# EAGLE design wireless_temp_sens (EAGLE 6.6.0)
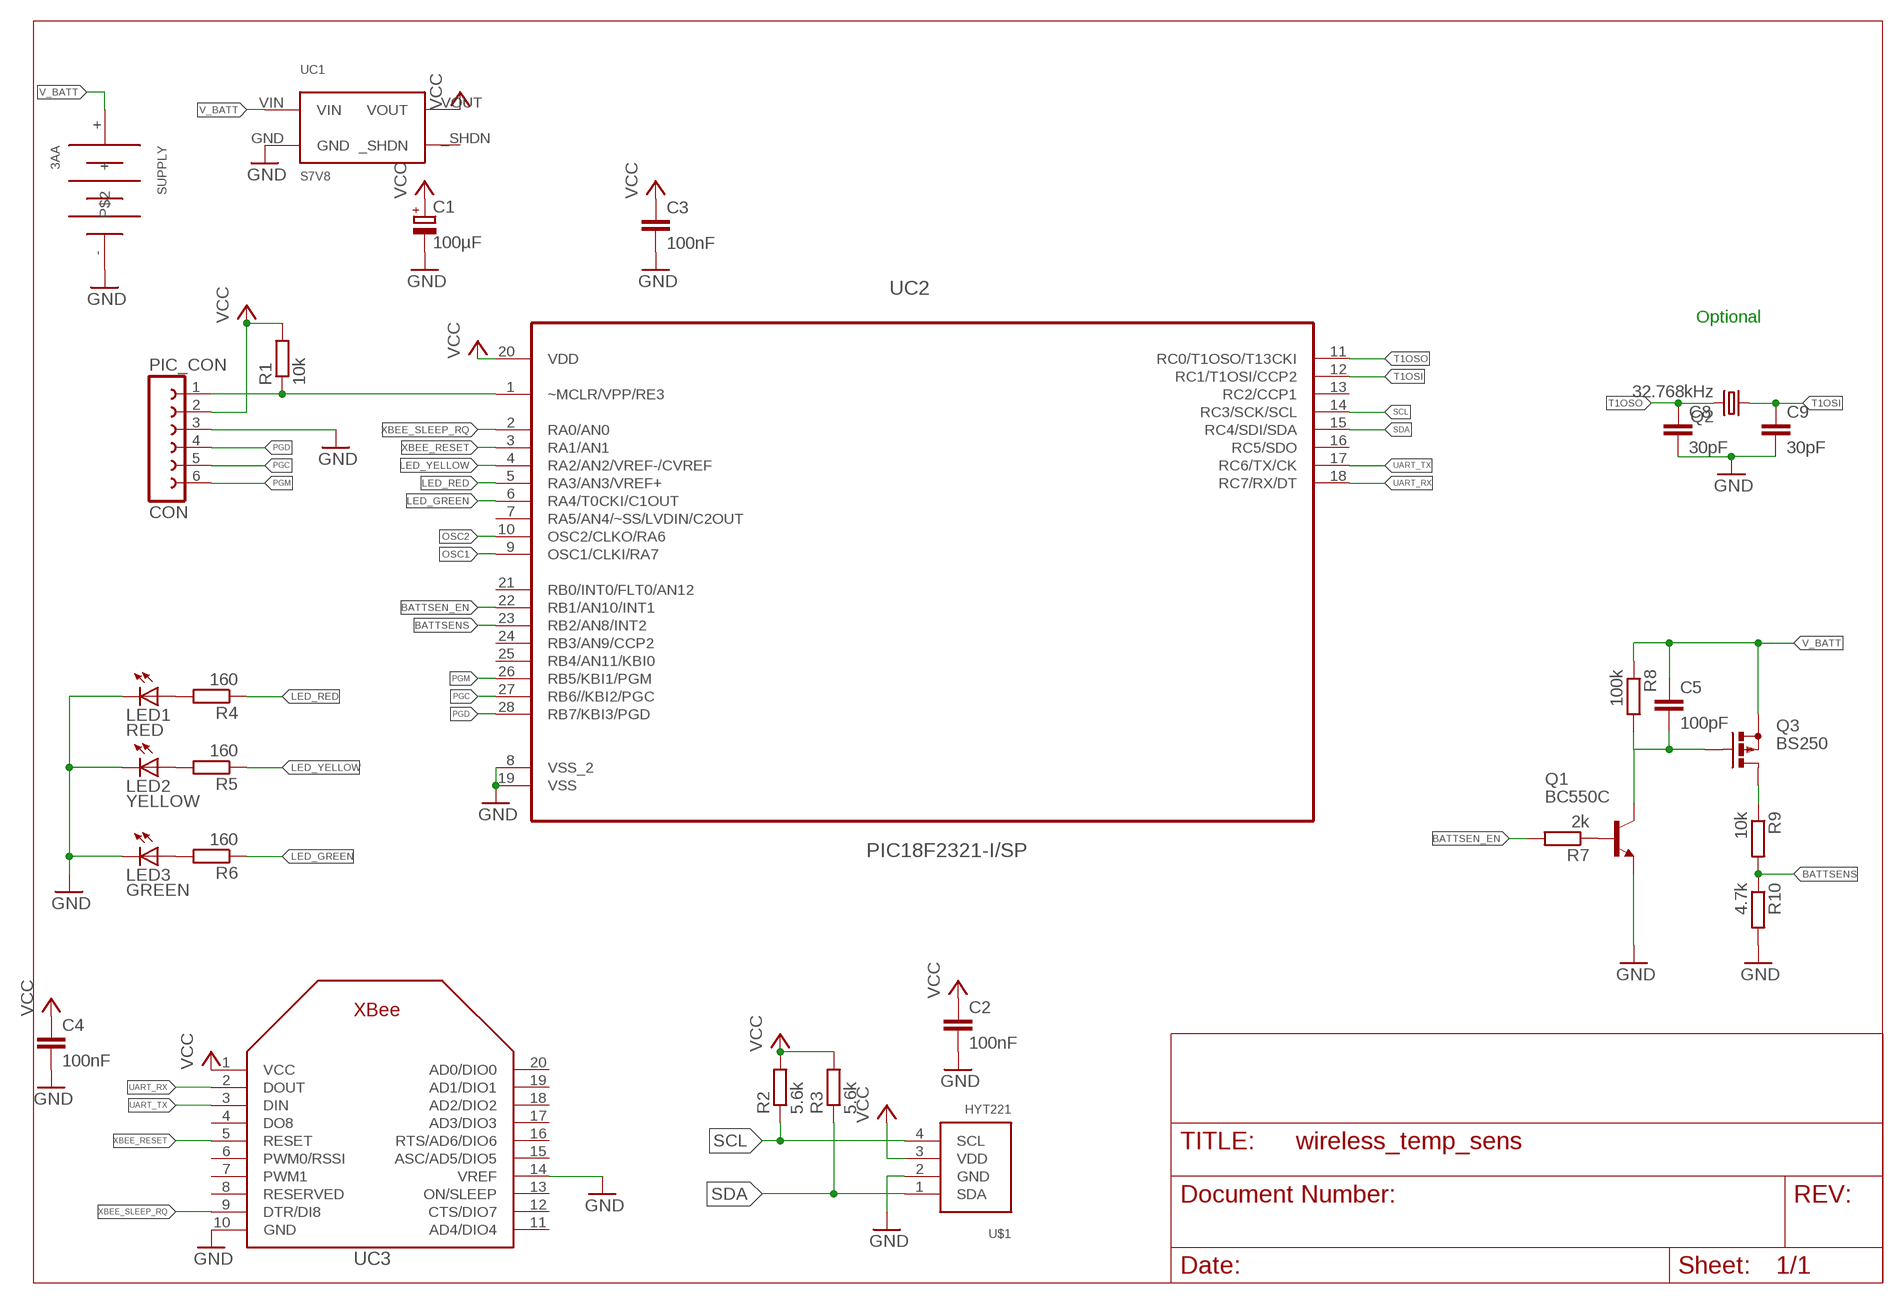
[diagram p0: schematic, sheet 1]

## Parts
C1  100µF  CPOL-EUE2.5-6  [E2,5-6]
C2  100nF  C-EU025-025X050  [C025-025X050]
C3  100nF  C-EU025-025X050  [C025-025X050]
C4  100nF  C-EU025-025X050  [C025-025X050]
C5  100pF  C-EU025-025X050  [C025-025X050]
C8  30pF  C-EU025-024X044  [C025-024X044]
C9  30pF  C-EU025-024X044  [C025-024X044]
CON  PIC_CON  FE06-1  [FE06]
LED1  RED  LED3MM  [LED3MM]
LED2  YELLOW  LED3MM  [LED3MM]
LED3  GREEN  LED3MM  [LED3MM]
Q1  BC550C  [TO92-EBC]
Q2  32.768kHz  CRYSTALTC26H  [TC26H]
Q3  BS250  [SOT54E]
R1  10k  R-EU_0204/7  [0204/7]
R2  5.6k  R-EU_0204/7  [0204/7]
R3  5.6k  R-EU_0204/7  [0204/7]
R4  160  R-EU_0204/7  [0204/7]
R5  160  R-EU_0204/7  [0204/7]
R6  160  R-EU_0204/7  [0204/7]
R7  2k  R-EU_0204/7  [0204/7]
R8  100k  R-EU_0204/7  [0204/7]
R9  10k  R-EU_0204/7  [0204/7]
R10  4.7k  R-EU_0204/7  [0204/7]
SUPPLY  3AA  [LR6-R6-R6P]
U$1  HYT221HYT221-CON  [HYT221-CON]
UC1  S7V8  [S7V8_P]
UC2  PIC18F2321-I/SP  [DIP254P762X508-28]
UC3  XBEE  [XBEE]

## Nets
BATTSEN_EN: R7.2 UC2.22(RB1/AN10/INT1)
BATTSENS: R9.2 R10.1 UC2.23(RB2/AN8/INT2)
GND: C1.- C2.2 C3.2 C4.2 C8.2 C9.2 CON.3 LED1.K(C) LED2.K(C) LED3.K(C) Q1.E R10.2 SUPPLY.- U$1.2(GND) UC1.GND UC2.8(VSS_2) UC2.19(VSS) UC3.10(GND) UC3.14(VREF)
LED_GREEN: R6.1 UC2.6(RA4/T0CKI/C1OUT)
LED_RED: R4.1 UC2.5(RA3/AN3/VREF+)
LED_YELLOW: R5.1 UC2.4(RA2/AN2/VREF-/CVREF)
N$1: Q1.B R7.1
N$2: CON.1 R1.1 UC2.1(~MCLR/VPP/RE3)
N$3: Q3.D R9.1
N$4: C5.2 Q1.C Q3.G R8.2
N$6: LED1.A R4.2
N$7: LED2.A R5.2
N$8: LED3.A R6.2
OSC1: UC2.9(OSC1/CLKI/RA7)
OSC2: UC2.10(OSC2/CLKO/RA6)
PGC: CON.5 UC2.27(RB6//KBI2/PGC)
PGD: CON.4 UC2.28(RB7/KBI3/PGD)
PGM: CON.6 UC2.26(RB5/KBI1/PGM)
SCL: R2.1 U$1.4(SCL) UC2.14(RC3/SCK/SCL)
SDA: R3.1 U$1.1(SDA) UC2.15(RC4/SDI/SDA)
T1OSI: C9.1 Q2.1 UC2.12(RC1/T1OSI/CCP2)
T1OSO: C8.1 Q2.2 UC2.11(RC0/T1OSO/T13CKI)
UART_RX: UC2.18(RC7/RX/DT) UC3.2(DOUT)
UART_TX: UC2.17(RC6/TX/CK) UC3.3(DIN)
V_BATT: C5.1 Q3.S R8.1 SUPPLY.+ UC1.VIN
VCC: C1.+ C2.1 C3.1 C4.1 CON.2 R1.2 R2.2 R3.2 U$1.3(VDD) UC1.VOUT UC2.20(VDD) UC3.1(VCC)
XBEE_RESET: UC2.3(RA1/AN1) UC3.5(RESET)
XBEE_SLEEP_RQ: UC2.2(RA0/AN0) UC3.9(DTR/DI8)
Unconnected: UC1._SHDN UC2.7(RA5/AN4/~SS/LVDIN/C2OUT) UC2.13(RC2/CCP1) UC2.16(RC5/SDO) UC2.21(RB0/INT0/FLT0/AN12) UC2.24(RB3/AN9/CCP2) UC2.25(RB4/AN11/KBI0) UC3.4(DO8) UC3.6(PWM0/RSSI) UC3.7(PWM1) UC3.8(RESERVED) UC3.11(AD4/DIO4) UC3.12(CTS/DIO7) UC3.13(ON/SLEEP) UC3.15(ASC/AD5/DIO5) UC3.16(RTS/AD6/DIO6) UC3.17(AD3/DIO3) UC3.18(AD2/DIO2) UC3.19(AD1/DIO1) UC3.20(AD0/DIO0)

## Notes on the sheet
- Optional

## Library data of the parts
C1 = resistor:CPOL-EU: POLARIZED CAPACITOR, European symbol
C2-C5 C8 C9 = rcl:C-EU: CAPACITOR, European symbol
CON = con-lsta:FE06-1: FEMALE HEADER; OC_FARNELL: unknown; OC_NEWARK: unknown
LED1-LED3 = led:LED: LED OSRAM: - CHIPLED LG R971, LG N971, LY N971, LG Q971, LY Q971, LO R971, LY R971 LH N974, LH R974 LS Q976, LO Q976, LY Q976 LO Q996 - Hyper CHIPLED LW Q18S LB Q993, LB Q99A, LB R99A - SideLED LS A670, LO A670, LY A670, LG A670, LP A670 LB A673, LV A673, LT A673, LW A673 LH A674 LY A675 LS A676, LA A676, LO A676, LY A676, LW A676 LS A679, LY A679, LG A679 - Hyper Micro SIDELED® LS Y876, LA Y876, LO Y876, LY Y876 LT Y87S - SmartLED LW L88C, LW L88S LB L89C, LB L89S, LG L890 LS L89K, LO L89K, LY L89K LS L896, LA L896, LO L896, LY L896 - TOPLED LS T670, LO T670, LY T670, LG T670, LP T670 LSG T670, LSP T670, LSY T670, LOP T670, LYG T670 LG T671, LOG T671, LSG T671 LB T673, LV T673, LT T673, LW T673 LH T674 LS T676, LA T676, LO T676, LY T676, LB T676, LH T676, LSB T676, LW T676 LB T67C, LV T67C, LT T67C, LS T67K, LO T67K, LY T67K, LW E67C LS E67B, LA E67B, LO E67B, LY E67B, LB E67C, LV E67C, LT E67C LW T67C LS T679, LY T679, LG T679 LS T770, LO T770, LY T770, LG T770, LP T770 LB T773, LV T773, LT T773, LW T773 LH T774 LS E675, LA E675, LY E675, LS T675 LS T776, LA T776, LO T776, LY T776, LB T776 LHGB T686 LT T68C, LB T68C - Hyper Mini TOPLED® LB M676 - Mini TOPLED Santana® LG M470 LS M47K, LO M47K, LY M47K Source: http://www.osram.convergy.de LUXEON: - LUMILED® LXK2-PW12-R00, LXK2-PW12-S00, LXK2-PW14-U00, LXK2-PW14-V00 LXK2-PM12-R00, LXK2-PM12-S00, LXK2-PM14-U00 LXK2-PE12-Q00, LXK2-PE12-R00, LXK2-PE12-S00, LXK2-PE14-T00, LXK2-PE14-U00 LXK2-PB12-K00, LXK2-PB12-L00, LXK2-PB12-M00, LXK2-PB14-N00, LXK2-PB14-P00, LXK2-PB14-Q00 LXK2-PR12-L00, LXK2-PR12-M00, LXK2-PR14-Q00, LXK2-PR14-R00 LXK2-PD12-Q00, LXK2-PD12-R00, LXK2-PD12-S00 LXK2-PH12-R00, LXK2-PH12-S00 LXK2-PL12-P00, LXK2-PL12-Q00, LXK2-PL12-R00 Source: www.luxeon.com KINGBRIGHT: KA-3528ASYC Source: www.kingbright.com
Q1 = transistor-npn:BC550*: NPN Transistor
Q2 = crystal:CRYSTAL: CRYSTAL; OC_FARNELL: unknown; OC_NEWARK: unknown
Q3 = transistor-small-signal:BS250: P-CHANNEL MOS FET
R1-R10 = rcl:R-EU_: RESISTOR, European symbol
SUPPLY = ma_libs:3AA
U$1 = ma_libs:HYT221
UC1 = ma_libs:S7V8
UC2 = Microchip_By_element14_Batch_1:PIC18F2321-I/SP: High-Performance Enhanced Flash Microcontrollers; MPN: PIC18F2321-I/SP; OC_FARNELL: 1332236; OC_NEWARK: 31K5012; PACKAGE: DIP-28; SUPPLIER: Microchip
UC3 = adafruit:XBEE

## Board
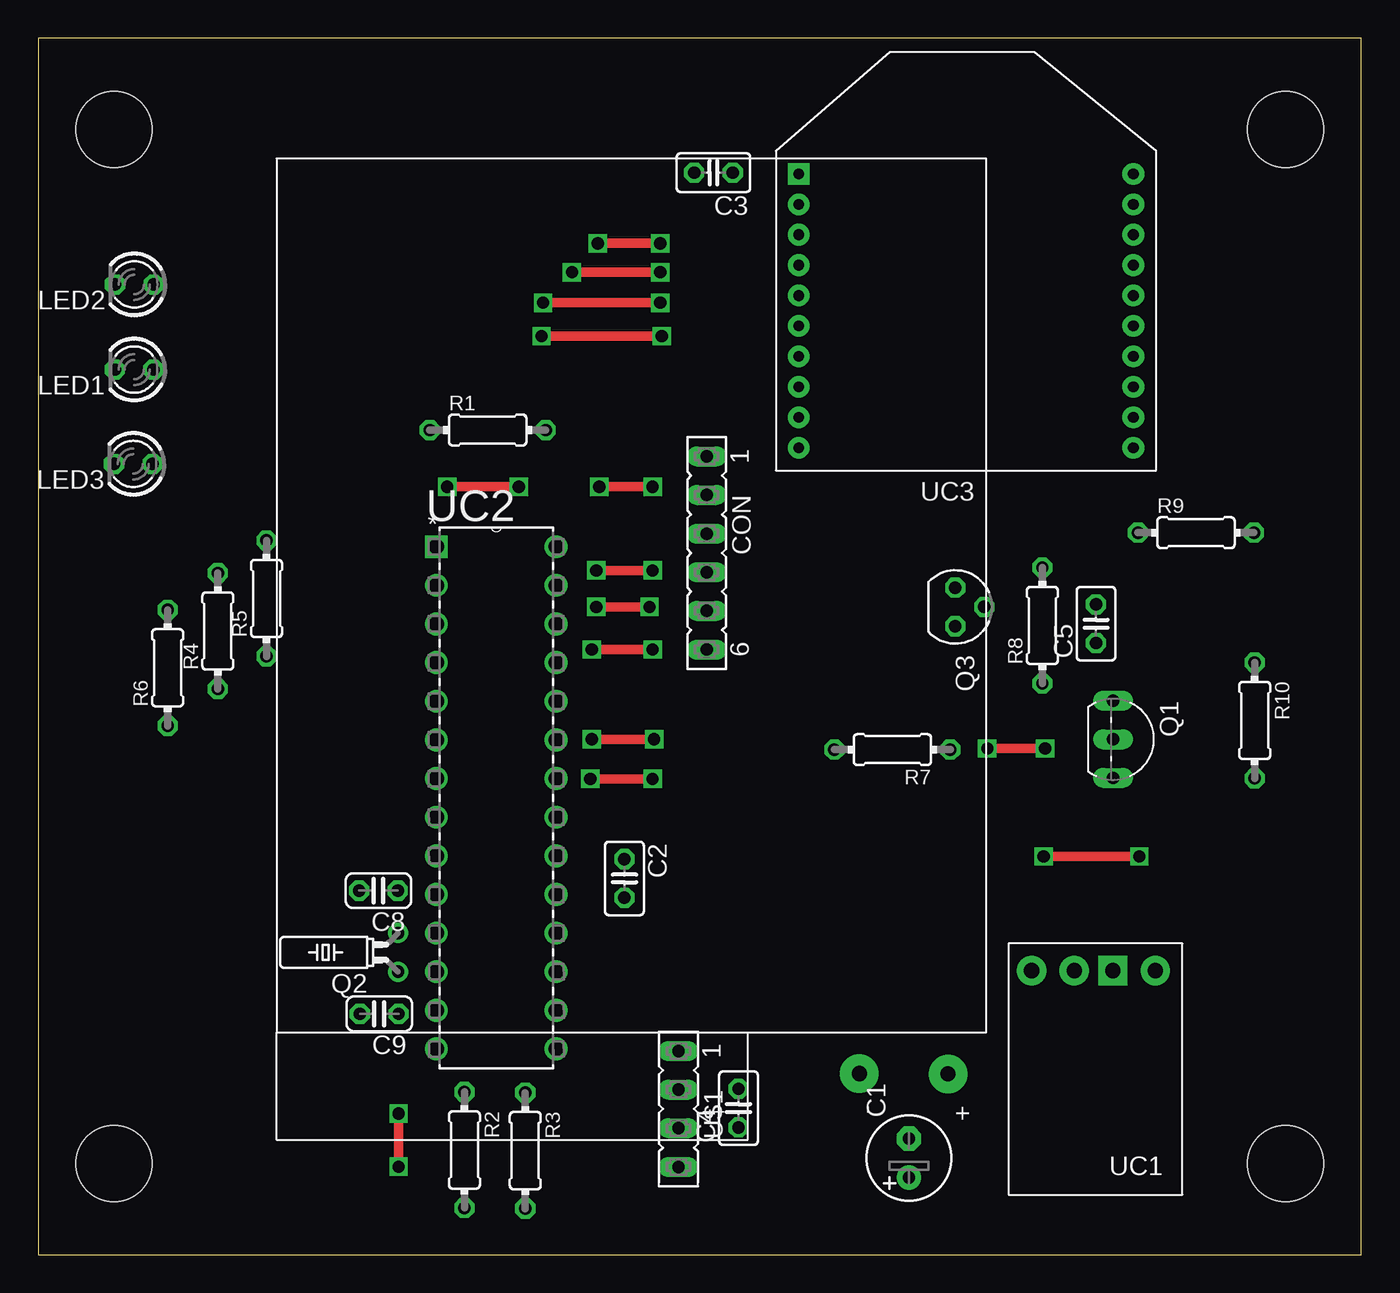
[diagram p1: board, top side]
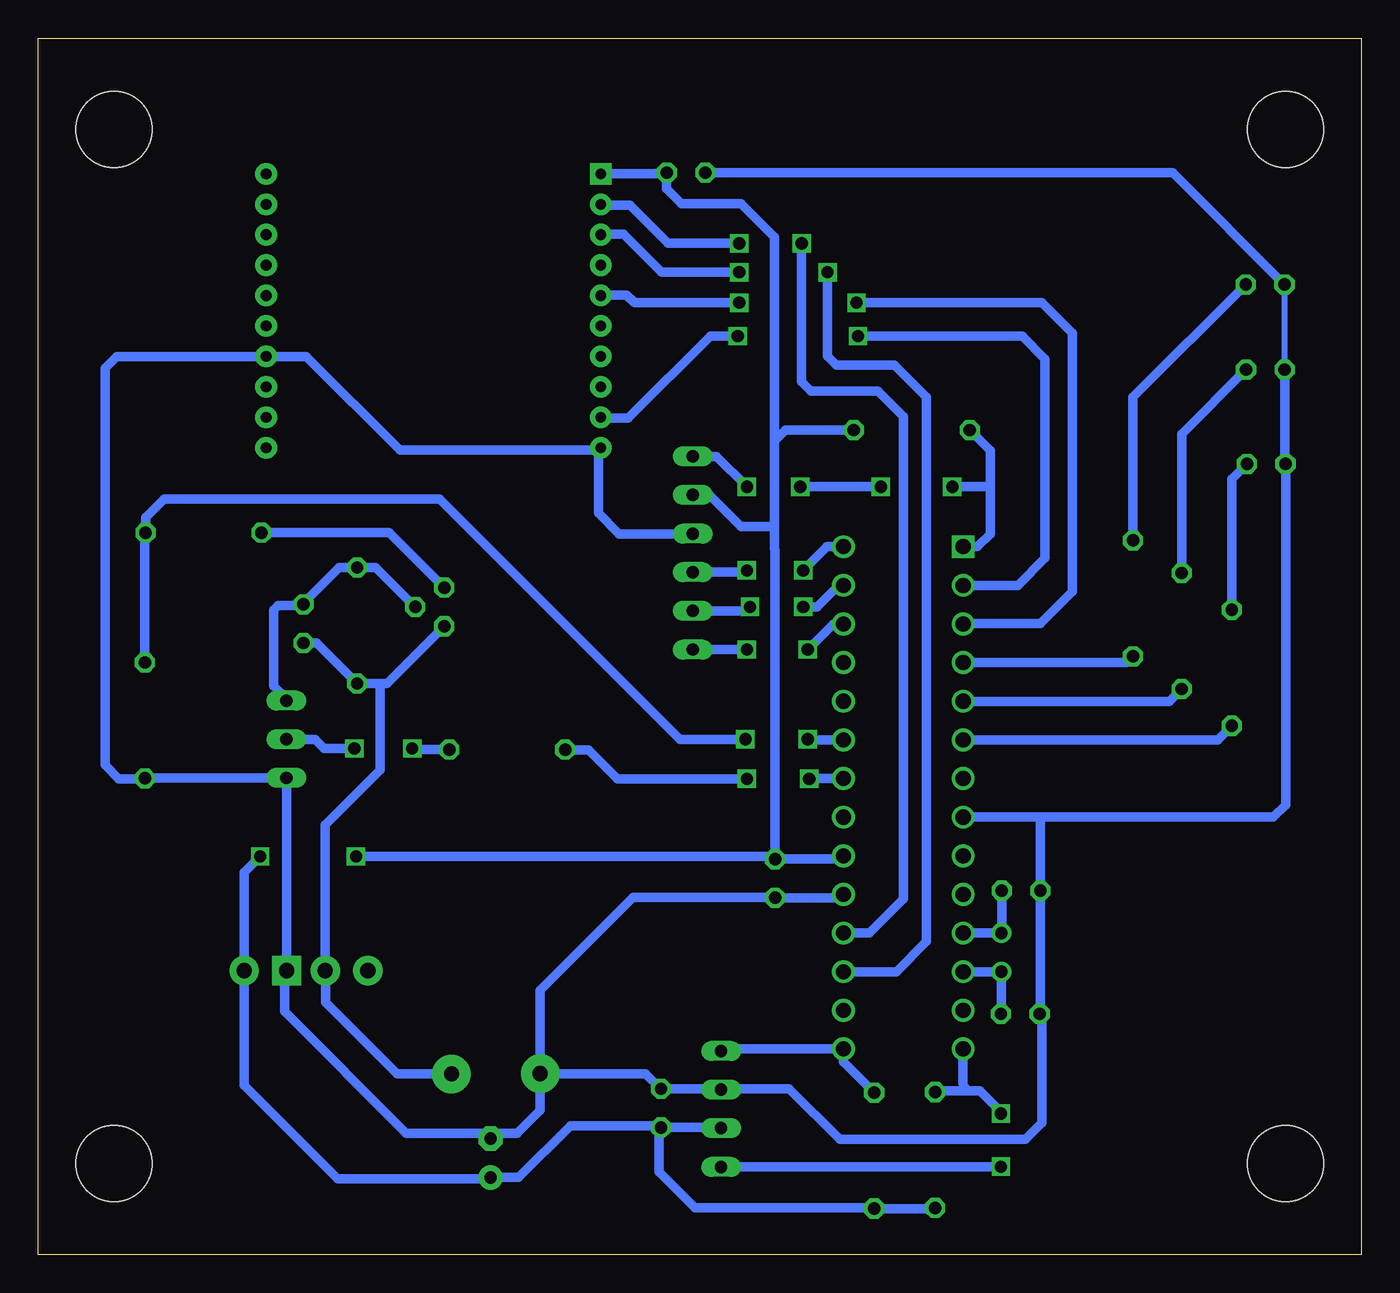
[diagram p2: board, bottom side, seen from below]

Size 87 x 80 mm. Coordinates in mm from the lower left corner, seen from the top.
Outline: 0,0 87,0 87,80 0,80 0,0
Copper layers (1*16): Top 0.035mm / dielectric 1.5mm / Bottom 0.035mm
Design rules "default": minimum track width 10mil, minimum drill 24mil, track to track 8mil, track to pad 8mil, pad to pad 8mil, via to via 8mil, smd to smd 8mil, copper to edge 40mil, drill to drill 8mil, minimum pad ring 10mil, minimum via ring 8mil, stop-mask expansion 4mil, vias tented up to drill 0mil, thermal gap 10mil
Holes 5 mm at 5,74 82,74 82,6 5,6

### Footprints (pad centres in the part's own frame; a part is rotated, then mirrored left to right if it is on the bottom)
E2,5-6 = drill 0.813 pad 1.6: + -1.27,0 | drill 0.813 pad 1.6 octagon: - 1.27,0
C025-025X050 = drill 0.813 octagon: 1 -1.27,0; 2 1.27,0
C025-024X044 = drill 0.813 octagon: 1 -1.27,0; 2 1.27,0
FE06 = drill 0.813 long: 1 -6.35,0; 2 -3.81,0; 3 -1.27,0; 4 1.27,0; 5 3.81,0; 6 6.35,0
LED3MM = drill 0.813 octagon: A -1.27,0; K 1.27,0
TO92-EBC = drill 0.813 long: B 0,-1.27; C -2.54,-1.27; E 2.54,-1.27
TC26H = drill 0.813: 1 -1.27,0; 2 1.27,0
SOT54E = drill 0.813 octagon: D -1.27,0; G 0,1.905; S 1.27,0
0204/7 = drill 0.813 octagon: 1 -3.81,0; 2 3.81,0
LR6-R6-R6P = drill 1 pad 2.54: + 60.17,44.15; - 60.14,38.32
HYT221-CON = drill 0.813 long: 1 -3.81,0; 2 -1.27,0; 3 1.27,0; 4 3.81,0
S7V8_P = drill 1 pad 1.93: _SHDN 9.906,1.778; VIN 7.112,1.778; VOUT 1.778,1.778 | drill 1 pad 1.93 square: GND 4.572,1.778
DIP254P762X508-28 = drill 0.991 square: 1 -7.874,33.02 | drill 0.991: 2 -7.874,30.48; 3 -7.874,27.94; 4 -7.874,25.4; 5 -7.874,22.86; 6 -7.874,20.32; 7 -7.874,17.78; 8 -7.874,15.24; 9 -7.874,12.7; 10 -7.874,10.16; 11 -7.874,7.62; 12 -7.874,5.08; 13 -7.874,2.54; 14 -7.874,0; 15 0,0; 16 0,2.54; 17 0,5.08; 18 0,7.62; 19 0,10.16; 20 0,12.7; 21 0,15.24; 22 0,17.78; 23 0,20.32; 24 0,22.86; 25 0,25.4; 26 0,27.94; 27 0,30.48; 28 0,33.02
XBEE = drill 0.7 pad 1.422 square: 1 -11,5.5 | drill 0.7 pad 1.422: 2 -11,3.5; 3 -11,1.5; 4 -11,-0.5; 5 -11,-2.5; 6 -11,-4.5; 7 -11,-6.5; 8 -11,-8.5; 9 -11,-10.5; 10 -11,-12.5; 11 11,-12.5; 12 11,-10.5; 13 11,-8.5; 14 11,-6.5; 15 11,-4.5; 16 11,-2.5; 17 11,-0.5; 18 11,1.5; 19 11,3.5; 20 11,5.5

### Placement (x,y rotation side)
C1  57.25,6.37 90 top
C2  38.55,24.75 270 top
C3  44.4,71.15 180 top
C4  46.05,9.65 90 top
C5  69.55,41.5 90 top
C8  22.38,23.95 180 top
C9  22.43,15.85 180 top
CON  43.95,46.15 270 top
LED1  6.32,58.2 180 top
LED2  6.33,63.8 180 top
LED3  6.26,52 180 top
Q1  71.94,33.9 270 top
Q2  23.67,19.89 90 top
Q3  60.3,42.6 270 top
R1  29.56,54.23 0 top
R2  28.03,6.9 270 top
R3  32.03,6.86 270 top
R4  11.82,41.02 90 top
R5  15.02,43.16 90 top
R6  8.52,38.6 90 top
R7  56.16,33.22 180 top
R8  66.02,41.38 90 top
R9  76.12,47.48 0 top
R10  79.98,35.14 270 top
SUPPLY  15.67,72.07 270 top
U$1  42.1,9.6 270 top
UC1  75.23,20.47 180 top
UC2  34.06,13.54 0 top
UC3  61,65.57 0 top

### Tracks (layer width: path | path; a pad name or v marks a point on that pad's centre or on a via)
BATTSEN_EN  (via drill 0.8)
  Top 0.61: v36.3,31.3 v40.4,31.3
  Bottom 0.406: 36.28,31.32 v36.3,31.3 | 52.33,33.2 R7.2
  Bottom 0.61: UC2.22 36.28,31.32 | v40.4,31.3 48.9,31.3 50.8,33.2 52.33,33.2
BATTSENS  (via drill 0.8)
  Top 0.61: v36.4,33.9 v40.5,33.9
  Bottom 0.61: UC2.23 36.36,33.86 v36.4,33.9 | v40.5,33.9 44.8,33.9 60.6,49.7 78.7,49.7 79.93,48.47 R9.2 79.98,47.43 R10.1
GND
  Bottom 0.406: LED2.K LED1.K | 5.05,52.06 LED3.K | 21.11,15.9 C9.2 | 21.2,15.81 C9.2 | 57.61,8 C1.- | 70.66,31.35 Q1.E | 79.95,31.36 R10.2 80.01,31.3 | 38.57,23.5 C2.2 | 50.17,52.9 UC3.10 | 21.11,28.77 21.1,28.78 | 21.47,15.54 C9.2 | SUPPLY.- | 42.15,10.92 U$1.2 | 21,15.69 C9.2
  Bottom 0.61: LED1.K 5.05,52.06 | LED3.K 4.99,29.6 5.81,28.78 21.1,28.78 UC2.8 | 21.11,15.9 C8.2 21.11,28.77 | 70.66,31.35 UC1.GND 70.8,18.55 70.8,16 62.8,8 57.61,8 55.5,8 54,9.5 SUPPLY.- 47.05,11.92 C4.2 42.15,10.92 37.62,10.92 34.3,7.6 22.1,7.6 21,8.7 21,15.69 | Q1.E 79.95,31.36 | C2.2 34.28,23.48 UC2.19 | 80.01,31.3 81.7,31.3 82.6,32.2 82.6,58.3 81.83,59.07 UC3.14 69.37,59.07 63.2,52.9 50.17,52.9 50.17,48.77 48.8,47.4 43.97,47.4 CON.3 | SUPPLY.- 53.99,17.41 47.9,23.5 38.57,23.5 | C3.2 12.41,71.15 LED2.K
LED_GREEN
  Bottom 0.61: UC2.6 9.45,33.86 R6.1
LED_RED
  Bottom 0.61: UC2.5 12.63,36.4 R4.1
LED_YELLOW
  Bottom 0.61: UC2.4 15.43,38.94 R5.1
N$1  (via drill 0.8)
  Top 0.61: v62.4,33.3 v66.2,33.3
  Bottom 0.406: 62.32,33.22 v62.4,33.3
  Bottom 0.61: Q1.B 68.8,33.9 68.2,33.3 v66.2,33.3 | R7.1 62.32,33.22
N$2  (via drill 0.8)
  Top 0.61: v40.4,50.5 v36.9,50.5 | v31.6,50.5 v26.9,50.5
  Bottom 0.406: 24.5,50.5 24.4,50.4
  Bottom 0.61: UC2.1 25.24,46.56 24.4,47.4 24.4,50.4 24.4,52.88 R1.1 | v36.9,50.5 v31.6,50.5 | v26.9,50.5 24.5,50.5 | CON.1 42.4,52.5 v40.4,50.5
N$3
  Bottom 0.61: R9.1 63.91,47.48 Q3.D
N$4
  Bottom 0.61: Q3.G 64.8,45.19 R8.2 67.2,45.2 69.55,42.85 C5.2 69.62,42.7 71.2,42.7 71.5,42.4 71.5,37.4 70.67,36.57 Q1.C
N$6
  Bottom 0.61: R4.2 11.82,53.97 LED1.A
N$7
  Bottom 0.61: R5.2 15.02,56.38 LED2.A
N$8
  Bottom 0.61: R6.2 8.52,51.01 LED3.A
PGC  (via drill 0.8)
  Top 0.61: v36.7,42.6 v40.2,42.6
  Bottom 0.61: UC2.27 34.38,44.02 35.8,42.6 v36.7,42.6 | 40.3,42.6 v40.2,42.6 40.2,42.34 CON.5
PGD  (via drill 0.8)
  Top 0.61: v36.7,45 v40.4,45
  Bottom 0.61: UC2.28 35.14,46.56 v36.7,45 | CON.4 40.4,44.88 v40.4,45
PGM  (via drill 0.8)
  Top 0.61: v36.4,39.8 v40.4,39.8
  Bottom 0.61: UC2.26 34.72,41.48 v36.4,39.8 | 40.4,39.7 v40.4,39.8 CON.6
SCL  (via drill 0.8)
  Top 0.61: v23.7,5.8 v23.7,9.3
  Bottom 0.406: v23.71,5.79 v23.7,5.8 | v23.7,9.3 23.7,9.4 | 27.94,10.8 R2.1 | 26.19,11.29 25.7,10.8
  Bottom 0.61: U$1.4 v23.71,5.79 | 23.7,9.4 25.1,10.8 25.7,10.8 27.94,10.8 | UC2.14 26.19,11.29
SDA
  Bottom 0.406: 41.97,13.54 U$1.1
  Bottom 0.61: 41.97,13.54 UC2.15 34.06,12.7 R3.1
T1OSI
  Bottom 0.406: 23.67,15.88 C9.1
  Bottom 0.61: UC2.12 Q2.1 23.67,15.88
T1OSO
  Bottom 0.406: 23.65,21.18 Q2.2
  Bottom 0.61: UC2.11 Q2.2 | C8.1 23.65,21.18
UART_RX  (via drill 0.8)
  Top 0.61: v36.8,66.5 v40.9,66.5
  Bottom 0.406: 49.93,69 UC3.2
  Bottom 0.61: UC2.18 32.34,21.16 30.1,23.4 30.1,55.1 31.8,56.8 36.2,56.8 36.8,57.4 v36.8,66.5 | v40.9,66.5 45.6,66.5 48.1,69 49.93,69
UART_TX  (via drill 0.8)
  Top 0.61: v35.1,64.6 v40.9,64.6
  Bottom 0.406: 49.97,67.1 UC3.3
  Bottom 0.61: UC2.17 30.58,18.62 28.6,20.6 28.6,56.4 30.7,58.5 34.5,58.5 35.1,59.1 v35.1,64.6 | v40.9,64.6 46,64.6 48.5,67.1 49.97,67.1
V_BATT
  Bottom 0.406: 68.1,18.67 UC1.VIN
  Bottom 0.61: SUPPLY.+ 63.4,11.9 68.1,16.6 68.1,18.67 | UC1.VIN 68.12,28.28 64.5,31.9 64.5,37.37 64.3,37.57 | C5.1 68.68,40.23 R8.1 64.3,37.57 | 64.3,37.57 64.06,37.57 Q3.S
VCC  (via drill 0.8)
  Top 0.61: v72.4,26.2 v66.1,26.2
  Bottom 0.406: 57.35,5 C1.+ | 45.75,71.07 C3.1 | 45.6,71.08 C3.1 | 38.55,46.35 38.6,46.4 | 45.7,71.12 C3.1 | 38.73,26.2 C2.1 | 46.17,8.5 C4.1 | 42.15,8.38 U$1.3 | 32.08,3.1 R3.2 | 28.07,3.05 R2.2
  Bottom 0.61: 57.35,5 67.3,5 73.45,11.15 UC1.VOUT 73.45,25.15 v72.4,26.2 | UC3.1 45.75,71.07 | UC2.20 34.28,26.02 C2.1 38.55,46.35 | 38.6,46.4 38.6,47.7 | 38.6,47.7 38.6,53.5 | 38.6,53.5 38.6,66.9 40.8,69.1 44.7,69.1 45.7,70.1 45.7,71.12 | v66.1,26.2 38.73,26.2 | C1.+ 55.4,5.1 52,8.5 46.17,8.5 46.17,5.47 43.8,3.1 32.08,3.1 | C4.1 42.15,8.38 | R3.2 28.07,3.05 | CON.2 42.86,49.96 40.8,47.9 38.8,47.9 38.6,47.7 | R1.2 37.87,54.23 38.6,53.5
XBEE_RESET  (via drill 0.8)
  Top 0.61: v33.2,62.6 v40.9,62.6
  Bottom 0.406: 26.17,41.5 UC2.3 | 49.97,63.1 UC3.5
  Bottom 0.61: 26.17,41.5 21.1,41.5 19,43.6 19,60.6 21,62.6 v33.2,62.6 | v40.9,62.6 47.8,62.6 48.3,63.1 49.97,63.1
XBEE_SLEEP_RQ  (via drill 0.8)
  Top 0.61: v33.1,60.4 v41,60.4
  Bottom 0.61: UC2.2 22.58,44.02 20.8,45.8 20.8,58.9 22.3,60.4 v33.1,60.4 | v41,60.4 42.8,60.4 48.2,55 49.93,55 UC3.9